# EAGLE schematic OpenStratos (EAGLE 7.1.0)
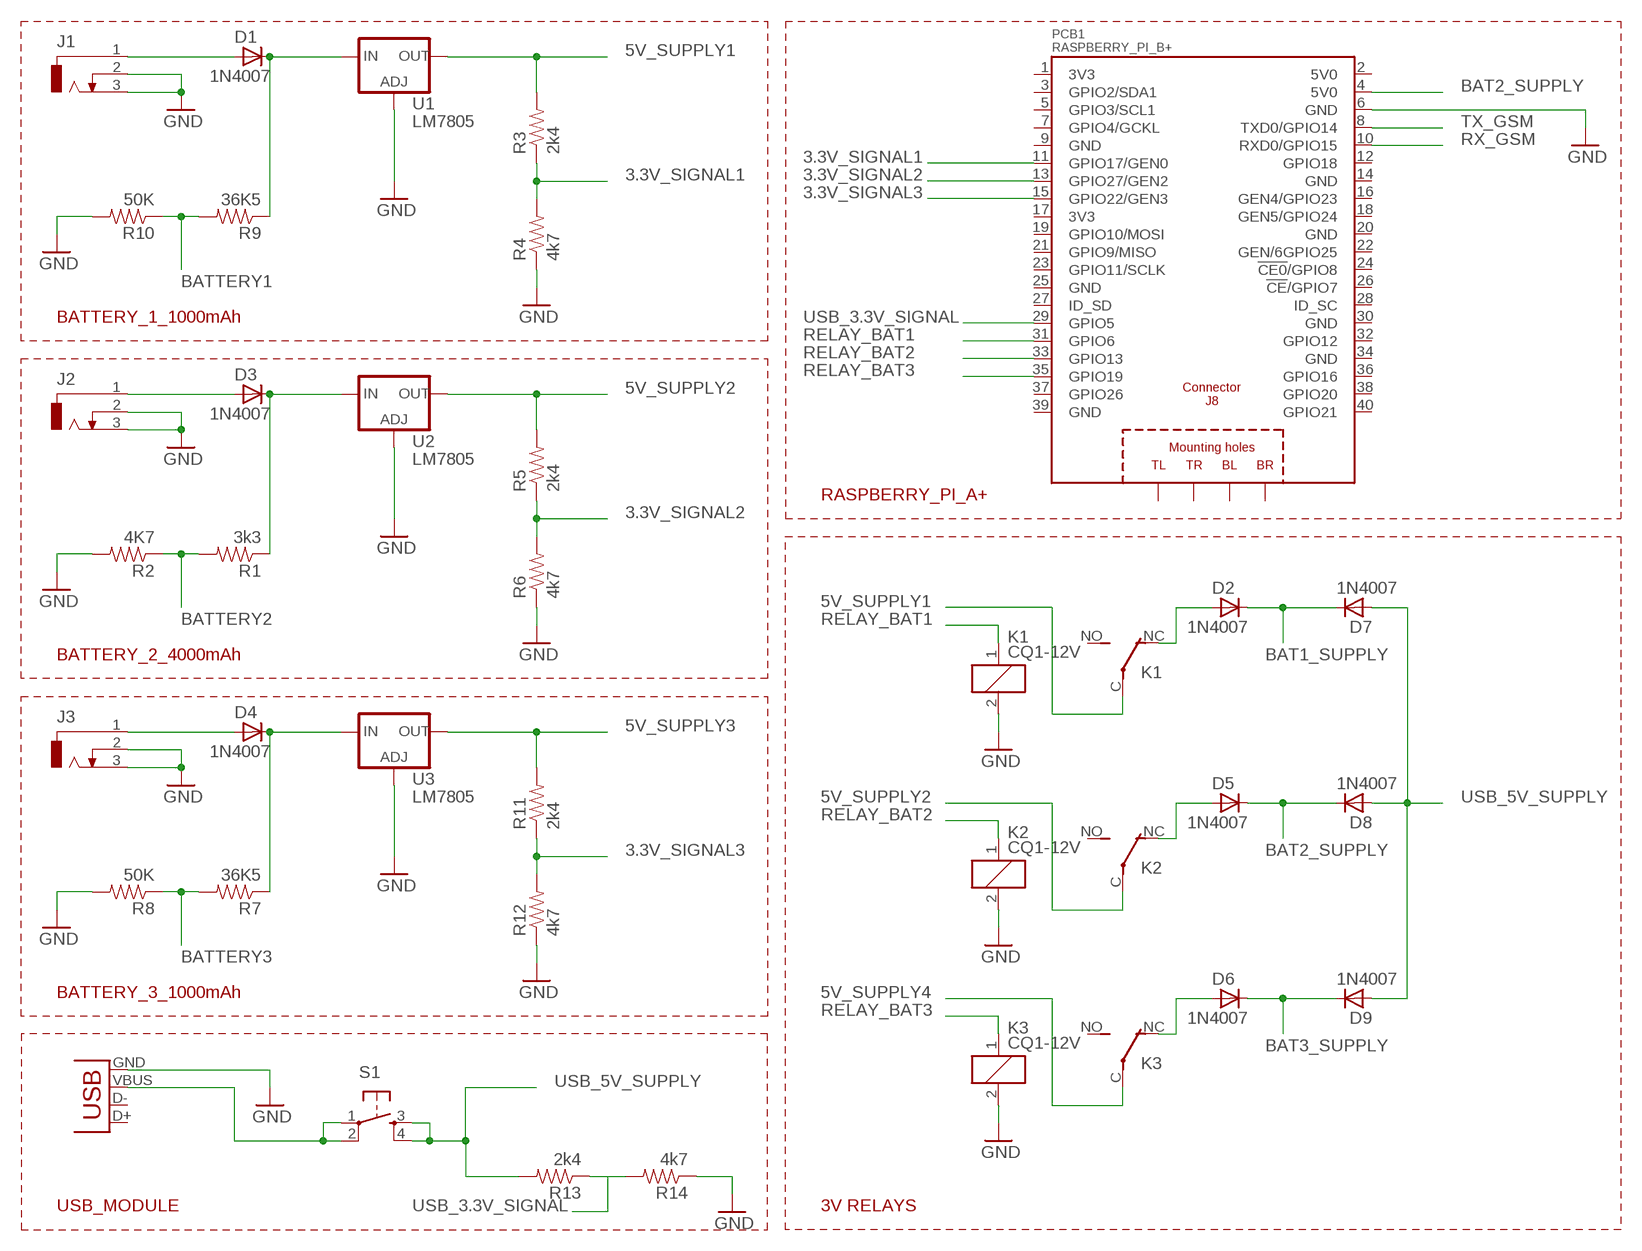
[diagram p0: schematic, sheet 1]

## Parts
D1  1N4007  [DO35-7]
D2  1N4007  [DO35-7]
D3  1N4007  [DO35-7]
D4  1N4007  [DO35-7]
D5  1N4007  [DO35-7]
D6  1N4007  [DO35-7]
D7  1N4007  [DO35-7]
D8  1N4007  [DO35-7]
D9  1N4007  [DO35-7]
J1  DC_JACK  [CON-JACK]
J2  DC_JACK  [CON-JACK]
J3  DC_JACK  [CON-JACK]
JP1  USB-MB-H  [USB-MB-H]
K1  CQ1-12V  [CQ1]
K2  CQ1-12V  [CQ1]
K3  CQ1-12V  [CQ1]
PCB1  RASPBERRY_PI_B+  [RASPBERRY_PI_B+]
R1  3k3  RESISTOREZ  [AXIAL-0.3EZ]
R2  4K7  RESISTOREZ  [AXIAL-0.3EZ]
R3  2k4  RESISTOREZ  [AXIAL-0.3EZ]
R4  4k7  RESISTOREZ  [AXIAL-0.3EZ]
R5  2k4  RESISTOREZ  [AXIAL-0.3EZ]
R6  4k7  RESISTOREZ  [AXIAL-0.3EZ]
R7  36K5  RESISTOREZ  [AXIAL-0.3EZ]
R8  50K  RESISTOREZ  [AXIAL-0.3EZ]
R9  36K5  RESISTOREZ  [AXIAL-0.3EZ]
R10  50K  RESISTOREZ  [AXIAL-0.3EZ]
R11  2k4  RESISTOREZ  [AXIAL-0.3EZ]
R12  4k7  RESISTOREZ  [AXIAL-0.3EZ]
R13  2k4  RESISTOREZ  [AXIAL-0.3EZ]
R14  4k7  RESISTOREZ  [AXIAL-0.3EZ]
S1  TAC_SWITCHPTH  [TACTILE-PTH]
U1  LM7805  V_REG_317SINK  [TO220-ADJ]
U2  LM7805  V_REG_317SINK  [TO220-ADJ]
U3  LM7805  V_REG_317SINK  [TO220-ADJ]

## Nets
3.3V_SIGNAL1: PCB1.11(GPIO17/GEN0) R3.P$1 R4.P$2
3.3V_SIGNAL2: PCB1.13(GPIO27/GEN2) R5.P$1 R6.P$2
3.3V_SIGNAL3: PCB1.15(GPIO22/GEN3) R11.P$1 R12.P$2
5V_BAT1: D2.A K1.NC(2:O)
5V_BAT2: D5.A
5V_BAT3: D6.A
5V_BAT4: K2.NC(2:O)
5V_BAT5: K3.NC(2:O)
5V_SUPPLY1: K1.C(2:P) R3.P$2 U1.OUT
5V_SUPPLY2: K2.C(2:P) R5.P$2 U2.OUT
5V_SUPPLY3: R11.P$2 U3.OUT
5V_SUPPLY4: K3.C(2:P)
BAT1_SUPPLY: D2.C D7.C
BAT2_SUPPLY: D5.C D8.C PCB1.4(5V0)
BAT3_SUPPLY: D6.C D9.C
BATTERY1: R9.P$2 R10.P$1
BATTERY2: R1.P$2 R2.P$1
BATTERY3: R7.P$2 R8.P$1
GND: J1.2 J1.3 J2.2 J2.3 J3.2 J3.3 JP1.GND PCB1.6(GND) R2.P$2 R4.P$1 R6.P$1 R8.P$2 R10.P$2 R12.P$1 R14.P$1 U1.ADJ U2.ADJ U3.ADJ
N$1: D1.A J1.1
N$2: D3.A J2.1
N$3: D3.C R1.P$1 U2.IN
N$4: D1.C R9.P$1 U1.IN
N$5: D4.A J3.1
N$6: D4.C R7.P$1 U3.IN
N$8: JP1.VBUS S1.1 S1.2
RELAY_BAT1: K1.1 K1.2 K2.2 K3.2 PCB1.31(GPIO6) ; supply symbol labelled GND
RELAY_BAT2: K2.1 PCB1.33(GPIO13)
RELAY_BAT3: K3.1 PCB1.35(GPIO19)
RX_GSM: PCB1.10(RXD0/GPIO15)
TX_GSM: PCB1.8(TXD0/GPIO14)
USB_3.3V_SIGNAL: PCB1.29(GPIO5) R13.P$1 R14.P$2
USB_5V_SUPPLY: D7.A D8.A D9.A R13.P$2 S1.3 S1.4
Unconnected: JP1.D+ JP1.D- K1.NO(2:S) K2.NO(2:S) K3.NO(2:S) PCB1.1(3V3) PCB1.2(5V0) PCB1.3(GPIO2/SDA1) PCB1.5(GPIO3/SCL1) PCB1.7(GPIO4/GCKL) PCB1.9(GND) PCB1.12(GPIO18) PCB1.14(GND) PCB1.16(GEN4/GPIO23) PCB1.17(3V3) PCB1.18(GEN5/GPIO24) PCB1.19(GPIO10/MOSI) PCB1.20(GND) PCB1.21(GPIO9/MISO) PCB1.22(GEN/6GPIO25) PCB1.23(GPIO11/SCLK) PCB1.24(!CE0!/GPIO8) PCB1.25(GND) PCB1.26(!CE!/GPIO7) PCB1.27(ID_SD) PCB1.28(ID_SC) PCB1.30(GND) PCB1.32(GPIO12) PCB1.34(GND) PCB1.36(GPIO16) PCB1.37(GPIO26) PCB1.38(GPIO20) PCB1.39(GND) PCB1.40(GPIO21) PCB1.PE_BL(BL) PCB1.PE_BR(BR) PCB1.PE_TL(TL) PCB1.PE_TR(TR)

## Notes on the sheet
- BATTERY_1_1000mAh
- RASPBERRY_PI_A+
- BATTERY_2_4000mAh
- BATTERY_3_1000mAh
- USB_MODULE | 3V RELAYS

## Library data of the parts
D1-D9 = Diode:1N4007: DIODE general purpose rectifier, 1 A
J1-J3 = Connectors:DC_JACK: DC POWER JACK Source: DCJ0303.pdf; OC_FARNELL: unknown; OC_NEWARK: unknown
JP1 = SparkFun-Connectors:USB: USB Connectors USB-B-PTH is fully proven SKU : PRT-00139/CONN-08278 USB-miniB is fully proven SKU : PRT-00587 USB-A-PCB is untested. USB-A-H is throughly reviewed, but untested. Spark Fun Electronics SKU : PRT-00437 USB-B-SMT is throughly reviewed, but untested. Needs silkscreen touching up. USB-A-S has not been used/tested USB-MB-H has not been used/tested USB-MICROB has been used. CONN-09505
K1-K3 = relay:CQ1-12V: AUTOMOTIVE QUIET RELAY NAiS Source: http://www.mew-europe.com/.. en_ds_61208_0000.pdf
PCB1 = RASPBERRY_PI_Bplus:RASPBERRY_PI_B+: Raspberry Pi B+ Based on issue: Thursday, July 10, 2014 - Rev 1.2 LBR by Tim R. 07-2014
R1-R14 = SparkFun-Passives:RESISTOR: Resistor Basic schematic elements and footprints for 0603, 1206, and PTH resistors.
S1 = SparkFun-Retired:TAC_SWITCH: Momentary Switch Button commonly used for reset or general input. Spark Fun Electronics SKU : COM-00097 SMT- SWCH-08247
U1-U3 = SparkFun-PowerIC:V_REG_317: Voltage Regulator Standard LM317 adjustable voltage regulator. AOI (Adjust Output Input). Google 'LM317 Calculator' for easy to use app to get the two resistor values needed. 240/720 for 5V output. 240/390 for 3.3V output. Spark Fun Electronics SKU : COM-00527